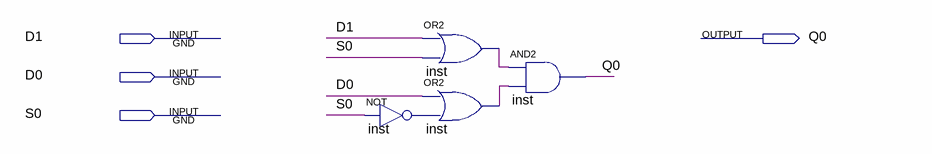
[diagram p0: schematic sheet]
// Quartus schematic MX2x1.bdf as structural Verilog: 4 symbols, 4 pins
module MX2x1 (
  input  D1,
  input  D0,
  input  S0,
  output Q0
);

  wire inst_out, inst_out_2, inst_out_3;

  or inst (inst_out_2, D1, S0);
  or inst_dup2 (inst_out, D0, inst_out_3);
  not inst_dup3 (inst_out_3, S0);
  and inst_dup4 (Q0, inst_out_2, inst_out);
endmodule
